# Altium schematic sheet STM32F103C4T6A.SchDoc
size A; SheetNumber: 2; SheetTotal: 3
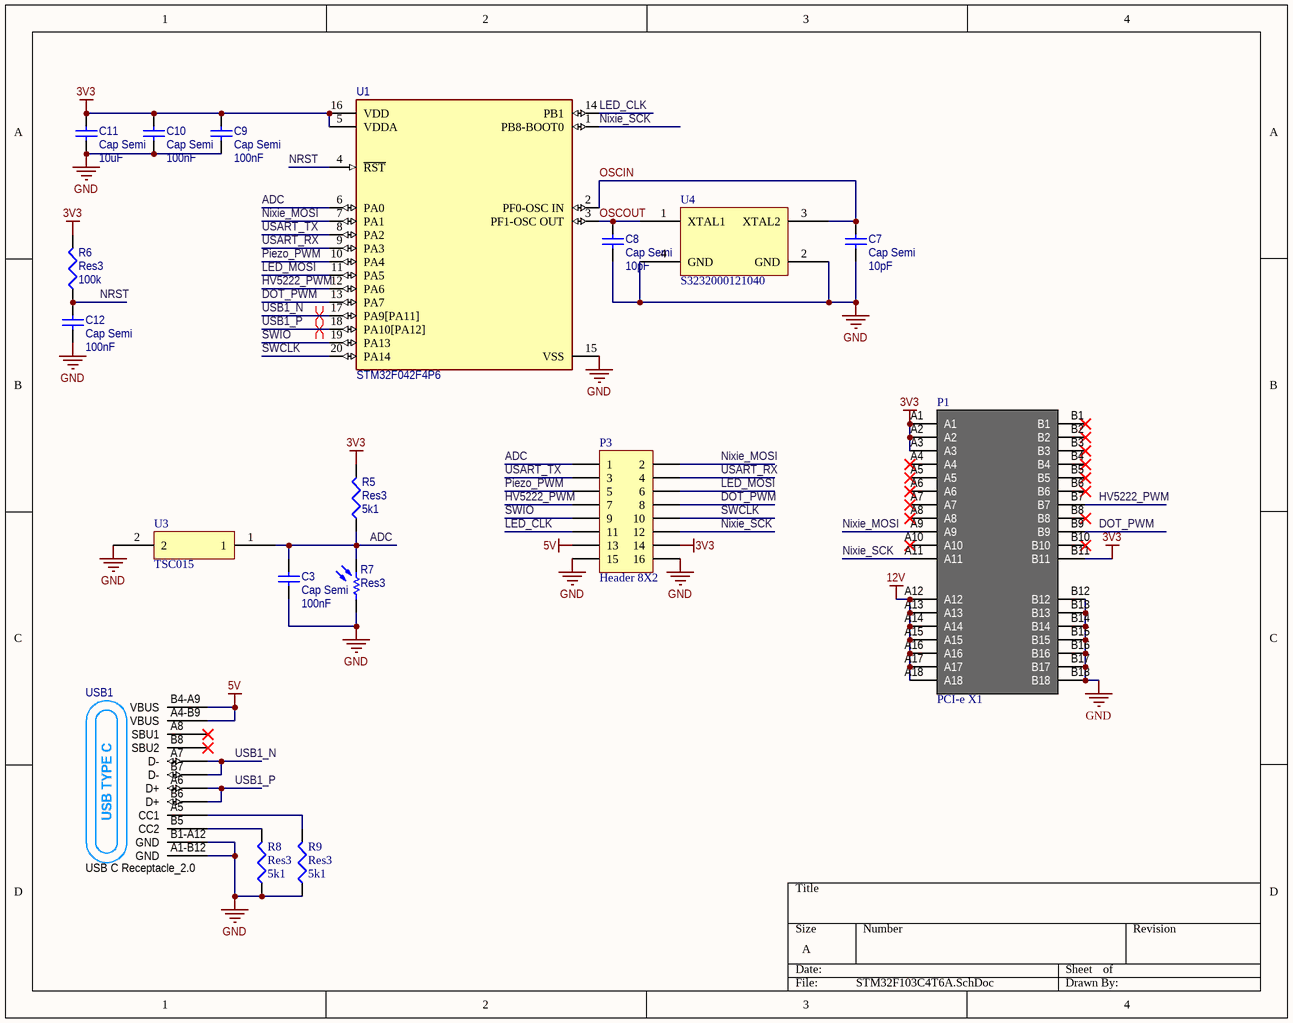
[diagram p0: STM32F103C4T6A.SchDoc]

## Parts
C3  Cap Semi  value 100nF  [0402]
C7  Cap Semi  value 10pF  [0402]
C8  Cap Semi  value 10pF  [0402]
C9  Cap Semi  value 100nF  [0402]
C10  Cap Semi  value 100nF  [0402]
C11  Cap Semi  value 10uF  [1608[0603]]
C12  Cap Semi  value 100nF  [0402]
P1  PCI-e X1  [10018784-10210TLF]
P3  Header 8X2  [HDR2X8]
R5  Res3  value 5k1  [J1-0603]
R6  Res3  value 100k  [J1-0603]
R7  Res3  [J1-0603]
R8  Res3  value 5k1  [J1-0603]
R9  Res3  value 5k1  [J1-0603]
U1  STM32F042F4P6  [FP-TSSOP20-YA-MFG]
U3  TSC015  [TSC015]
U4  S3232000121040  [SMD3225]
USB1  USB C Receptacle_2.0  [TYPE-C16PIN-CONNECTOR]

## Nets
3V3: C9.2 C10.2 C11.2 P1.A1 P1.A2 P1.A3 P1.B11 P3.14 R5.2 R6.2 U1.5(VDDA) U1.16(VDD)
5V: P3.13 USB1.A4-B9(VBUS) USB1.B4-A9(VBUS)
12V: P1.A12 P1.A13 P1.A14 P1.A15 P1.A16 P1.A17 P1.A18
GND: C3.1 C7.1 C8.2 C9.1 C10.1 C11.1 C12.1 P1.B12 P1.B13 P1.B14 P1.B15 P1.B16 P1.B17 P1.B18 P3.15 P3.16 R7.1 R8.1 R9.1 U1.15(VSS) U3.2 U4.2(GND) U4.4(GND) USB1.A1-B12(GND) USB1.B1-A12(GND)
ADC: C3.2 P3.1 R5.1 R7.2 U1.6(PA0) U3.1
DOT_PWM: P1.B9 P3.8 U1.13(PA7)
HV5222_PWM: P1.B7 P3.7 U1.12(PA6)
LED_CLK: P3.11 U1.14(PB1)
LED_MOSI: P3.6 U1.11(PA5)
Nixie_MOSI: P1.A9 P3.2 U1.7(PA1)
Nixie_SCK: P1.A11 P3.12 U1.1(PB8-BOOT0)
NRST: C12.2 R6.1 U1.4(~{RST})
OSCIN: C7.2 U1.2(PF0-OSC_IN) U4.3(XTAL2)
OSCOUT: C8.1 U1.3(PF1-OSC_OUT) U4.1(XTAL1)
Piezo_PWM: P3.5 U1.10(PA4)
SWCLK: P3.10 U1.20(PA14)
SWIO: P3.9 U1.19(PA13)
USART_RX: P3.4 U1.9(PA3)
USART_TX: P3.3 U1.8(PA2)
USB1_N: U1.17(PA9[PA11]) USB1.A7(D-) USB1.B7(D-)
USB1_P: U1.18(PA10[PA12]) USB1.A6(D+) USB1.B6(D+)
NetR8_2: R8.2 USB1.B5(CC2)
NetR9_2: R9.2 USB1.A5(CC1)

Not connected (* = marked no-connect by the designer): P1 A4* A5* A6* A7* A8* A10* B1* B2* B3* B4* B5* B6* B8* B10*; USB1 A8(SBU1)* B8(SBU2)*

## Layout directives
differential pair: USB1_N, USB1_P

## Notes on the sheet
- (in symbol USB C Receptacle_2.0) USB TYPE C

## Library data of the parts
C3 C7-C12 = Cap Semi: Capacitor (Semiconductor SIM Model); Published: 8-Jun-2000; LatestRevisionDate: 29-May-2009; LatestRevisionNote: IPC-7351 Footprint Added.; PackageReference: C1206; Publisher: Altium Limited; PackageDescription: Chip Capacitor
  C11: Supplier 1: Digi-Key
P3 = Header 8X2: Header, 8-Pin, Dual row; LatestRevisionDate: 17-Jul-2002; LatestRevisionNote: Re-released for DXP Platform.; Publisher: Altium Limited
R5 R6 R8 R9 = Res3: Resistor; Published: 8-Jun-2000; LatestRevisionDate: 29-May-2009; LatestRevisionNote: IPC-7351 Footprint Added.; PackageReference: J1-0603; Publisher: Altium Limited; PackageDescription: Chip Resistor
R7 = CMP-2000-07406-1: Photoconductive Resistor, 200 kOhm, 100 V, 80 mW, -40 to 75 degC, 2-Pin THD, RoHS; Manufacturer: Excelitas Technology; SVHC: Cadmiumchloride(15-Jun-2015); Power Rating: 80mW; Resistance @ Lux: 12kohm; Voltage Rating: 100V; Product Range: -; Datasheet Version: 09/2006; Resistor Case Style: -; Operating Temperature Max: 75°C; Package Reference: VT90N1; Datasheet URL: http://datasheet.octopart.com/VT90N1-Excelitas-datasheet-10388451.pdf; Mounting Technology: ThroughHole; Operating Temperature Min: -40°C; Dark Resistance: 200kohm; Package Description: 2-Pin Through Hole Device, Body Width 4.17 mm (Max), Height 2.29 mm; Manufacturer URL: http://www.excelitas.com/Pages/Index.aspx; Packaging: Each
U1 = CMP-0304-00106-3: IC MCU 32BIT 16KB FLASH 20TSSOP; Manufacturer: STMicroelectronics; Number Of Spi Channels: 1; Number Of Timers/Counters: 6; Max Junction Temp: +105°C; Ram Size: 6KBytes; Max Supply Voltage: 3.6V; Core Architecture: ARM Cortex-M0; Number Of I/Os: 16; Memory Size: 16KBytes; Number Of Uart Channels: 2; Interface: I2C,SPI,UART,USART,CAN,USB,I2S,Other; Number Of Adc Channels: 12; Min Supply Voltage: 2V; Standoff Height: 0.05mm; Frequency: 48MHz; Nominal Supply Current: 0.4-20.5mA; Data Bus Width: 32bits; Category: IC; Temperature Range High: +85°C; Lead Free: Yes; Memory Type: FLASH; Number Of Usb Channels: 1; Number Of Pwm Channels: 6; Temperature Range Low: -40°C; ComponentLink2URL: https://www.st.com/resource/en/datasheet/stm32f042f4.pdf; Automotive: No; Ambient Temperature Range High: +85°C; Package: TSSOP20-YA; Digikey Description: IC MCU 32BIT 16KB FLASH 20TSSOP; Ipc Land Pattern Name: SOP65P640X120-20; Number Of A/D Converters: 1; Number Of I2C Channels: 1; Height: 1.2mm; Device Class L1: Integrated Circuits (ICs); Device Class L2: Embedded Processors and Controllers; Manufacturer Part Number: STM32F042F4P6; Temperature: -40°C to +85°C; Ambient Temperature Range Low: -40°C; RoHS: TRUE; Device Class L3: Microcontrollers; Number Of Cores: 1; ComponentLink2Description: Datasheet; Mouser Description: MCU 32-Bit STM32F ARM Cortex M0 RISC 16KB Flash 2.5V/3.3V 20-Pin TSSOP Tube; Octopart: https://octopart.com/stm32f042f4p6-stmicroelectronics-34084829
U3 = TSC015: Tactile Switch
U4 = S3232000121040: 32MHz SMD Crystal Resonator